# Altium schematic sheet DC-DC Converter_LT3845.SchDoc
size Legal
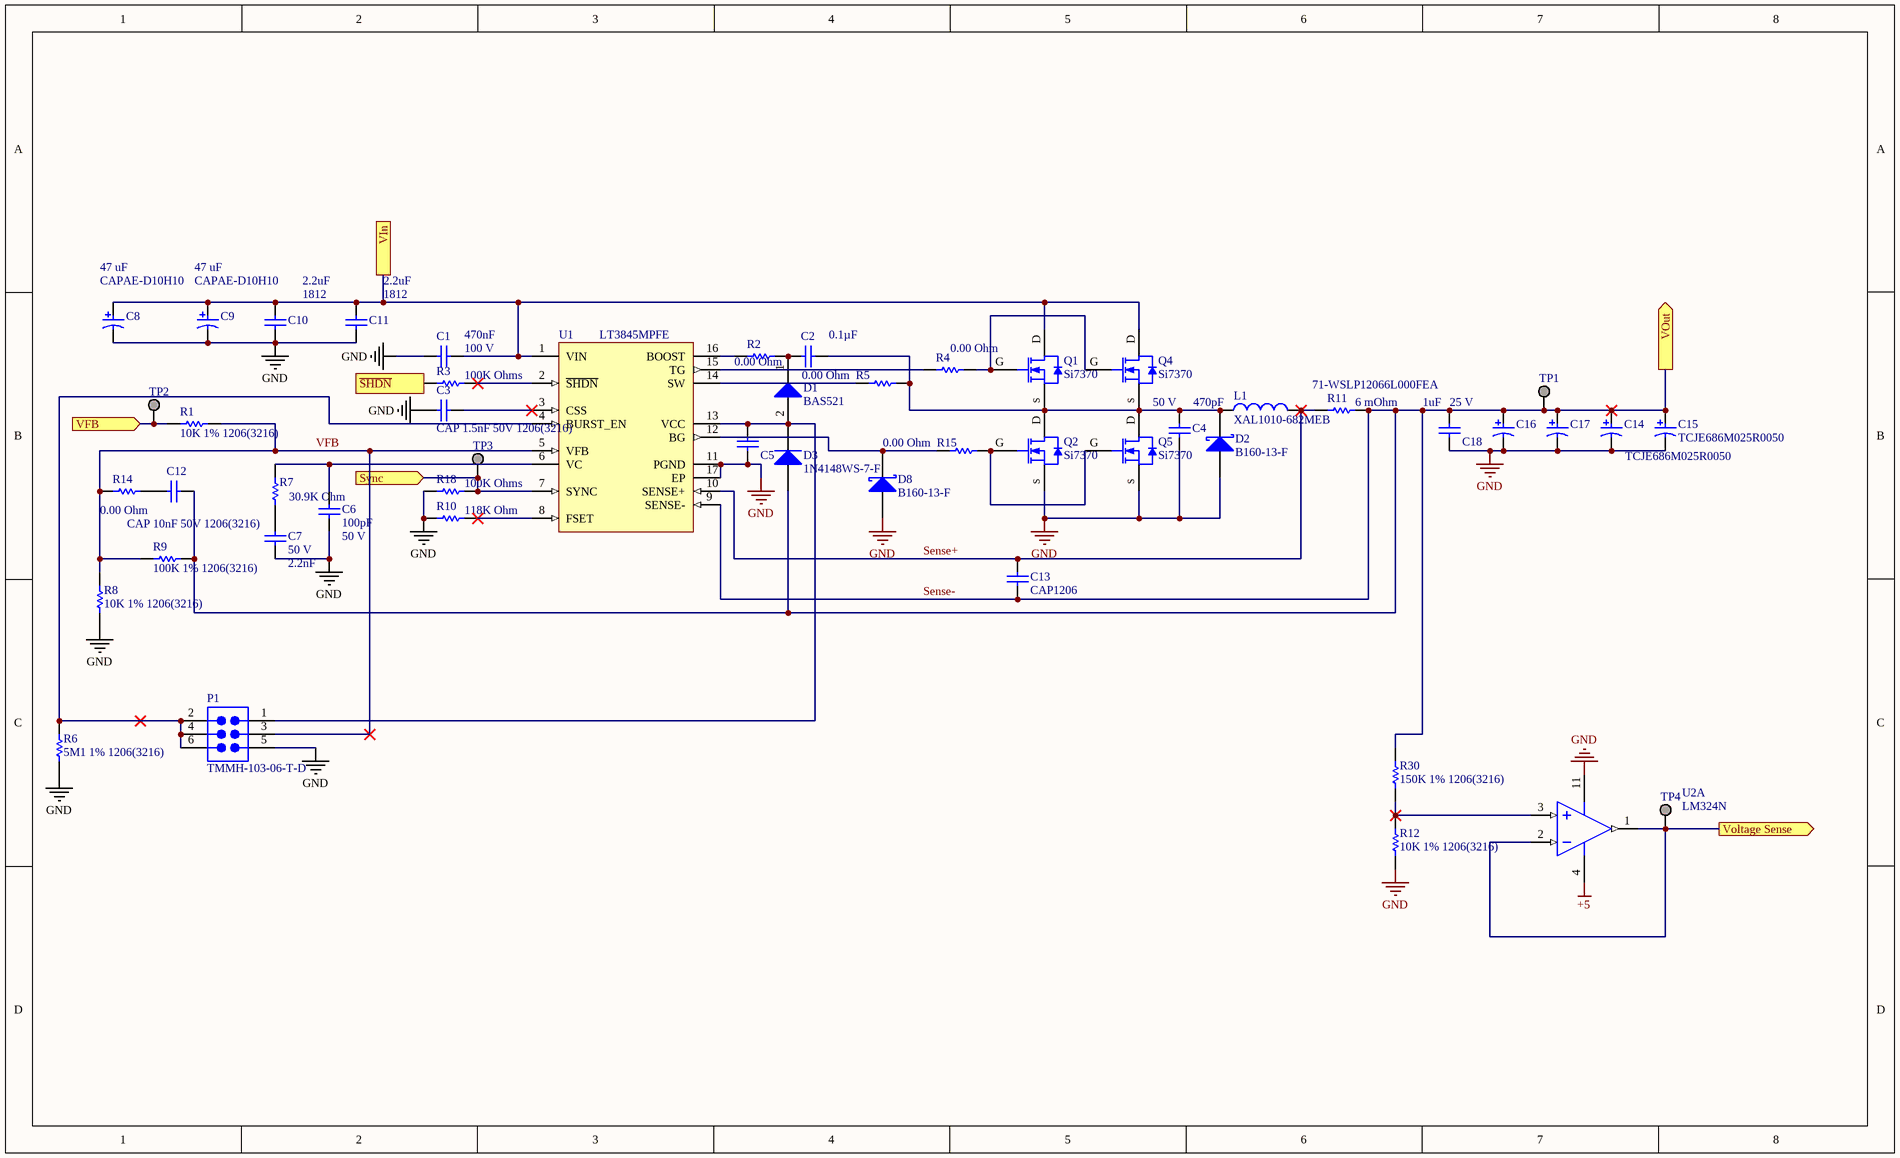
[diagram p0: DC-DC Converter_LT3845.SchDoc]

## Parts
C1  value 470nF  Rated Voltage: 100 V  [CAPC1206(3216)130_L]  (hidden comment: CAP 470nF 100V 1206(3216))
C2  Capacitance: 0.1µF  [KEMT-1206-2_N]  (hidden comment: C1206C104K5RACTU)
C3  CAP 1.5nF 50V 1206(3216)  [CAPC1206(3216)170_L]
C4  value 470pF  Rated Voltage: 50 V  [CAPC1206(3216)100_L]  (hidden comment: CAP 470pF 50V 1206(3216))
C5  CAP 1uF 25V 1206(3216)  [CAPC1206(3216)190_L]  (value not drawn)
C6  value 100pF  Rated Voltage: 50 V  [CAPC1206(3216)170_L]  (hidden comment: CAP 100pF 50V 1206(3216))
C7  value 2.2nF  Rated Voltage: 50 V  [CAPC1206(3216)130_L]  (hidden comment: CAP 2.2nF 50V 1206(3216))
C8  PackageReference: CAPAE-D10H10  Rated Capacitance: 47 uF  [NIC-CAPA2-10X10_V]  (hidden comment: UCZ1J470MCS1GS)
C9  PackageReference: CAPAE-D10H10  Rated Capacitance: 47 uF  [NIC-CAPA2-10X10_V]  (hidden comment: UCZ1J470MCS1GS)
C10  value 2.2uF  Case-EIA: 1812  [CAPC1812(4532)280_L]  (hidden comment: CAP 2.2uF 100V 1812(4532))
C11  value 2.2uF  Case-EIA: 1812  [CAPC1812(4532)280_L]  (hidden comment: CAP 2.2uF 100V 1812(4532))
C12  CAP 10nF 50V 1206(3216)  [CAPC1206(3216)170_L]
C13  CAP1206  [CAPC1206(3216)150_L]
C14  TCJE686M025R0050  [KEMT-520-D_N]
C15  TCJE686M025R0050  [KEMT-520-D_N]
C16  TAJB226K016RNJ  [AVX-TAJ-B-2_L]  (value not drawn)
C17  TAJB226K016RNJ  [AVX-TAJ-B-2_L]  (value not drawn)
C18  value 1uF  Rated Voltage: 25 V  [CAPC1206(3216)190_L]  (hidden comment: CAP 1uF 25V 1206(3216))
D1  PartNumber: BAS521  [ONSC-SOD-523-2-502-01_V]  (hidden comment: BAS16XV2T1)
D2  B160-13-F  [DIOD-SMA-2_V]
D3  1N4148WS-7-F  [DIOD-SOD323-2-A_V]
D8  B160-13-F  [DIOD-SMA-2_V]
L1  XAL1010-682MEB  [INDP113100X100N]
P1  TMMH-103-06-T-D  [SMTC-TMMH-103-06-X-D]
Q1  Si7370  [SOIC127P620X112_HS-9N]
Q2  Si7370  [SOIC127P620X112_HS-9N]
Q4  Si7370  [SOIC127P620X112_HS-9N]
Q5  Si7370  [SOIC127P620X112_HS-9N]
R1  10K 1% 1206(3216)  [RESC1206(3216)_L]
R2  value 0.00 Ohm  [RESC1206(3216)_L]  (hidden comment: Jumper 1206(3216))
R3  value 100K Ohms  [RESC1206(3216)_L]  (hidden comment: 100K 1% 1206(3216))
R4  value 0.00 Ohm  [RESC1206(3216)_L]  (hidden comment: Jumper 1206(3216))
R5  value 0.00 Ohm  [RESC1206(3216)_L]  (hidden comment: Jumper 1206(3216))
R6  5M1 1% 1206(3216)  [RESC1206(3216)_L]
R7  value 30.9K Ohm  [RESC1206(3216)_L]  (hidden comment: 30K9 1% 1206(3216))
R8  10K 1% 1206(3216)  [RESC1206(3216)_L]
R9  100K 1% 1206(3216)  [RESC1206(3216)_L]
R10  value 118K Ohm  [RESC1206(3216)_L]  (hidden comment: 118K 1% 1206(3216))
R11  value 6 mOhm  Supplier Part Number 1: 71-WSLP12066L000FEA  [RESC1206(3216)_L]  (hidden comment: WSLP12066L000FEA)
R12  10K 1% 1206(3216)  [RESC1206(3216)_L]
R14  value 0.00 Ohm  [RESC1206(3216)_L]  (hidden comment: Jumper 1206(3216))
R15  value 0.00 Ohm  [RESC1206(3216)_L]  (hidden comment: Jumper 1206(3216))
R18  value 100K Ohms  [RESC1206(3216)_L]  (hidden comment: 100K 1% 1206(3216))
R30  150K 1% 1206(3216)  [RESC1206(3216)_L]
TP1  VOut  [KSTN-1502-2]  (value not drawn)
TP2  VFB  [KSTN-1502-2]  (value not drawn)
TP3  Sync  [KSTN-1502-2]  (value not drawn)
TP4  Voltage Sense  [KSTN-1502-2]  (value not drawn)
U1  LT3845MPFE  [LT-FE-16-EPV-BC_N]
U2  LM324N  [N14A]  (part A of 4)

## Ports
Sync (in), VFB (in), VIn, Voltage Sense (out), VOut (out), ~{SHDN} (in)

## Nets
+5: U2.4(V+)
GND: C1.1 C3.1 C4.1 C5.1 C6.1 C7.1 C8.2 C9.2 C10.1 C11.1 C14.2 C15.2 C16.2 C17.2 C18.1 D2.1(A) D8.1(A) P1.5 Q2.S Q5.S R6.1 R8.1 R10.1 R12.2 R18.1 U1.11(PGND) U1.17(EP) U2.11(GND)
~{SHDN}: R3.1 ; port ~{SHDN}
Sense+: C13.2 L1.2 R11.1 U1.10(SENSE+)
Sense-: C12.2 C13.1 C14.1 C15.1 C16.1 C17.1 C18.2 D3.1(A) R9.2 R11.2 R30.2 TP1.1 U1.9(SENSE-) ; port VOut
Sync: R18.2 TP3.1 U1.7(SYNC) ; port Sync
VFB: P1.3 R1.2 R8.2 R9.1 R14.1 U1.5(VFB)
VFB: R1.1 TP2.1 ; port VFB  [a separate net that carries the same name]
VIn: C1.2 C8.1 C9.1 C10.2 C11.2 Q1.D Q4.D U1.1(VIN) ; port VIn
Voltage Sense: TP4.1 U2.1(OUT1) U2.2(IN1-) ; port Voltage Sense
NetC2_1: C2.1 D1.1(K) R2.2
NetC2_2: C2.2 C4.2 D2.2(K) L1.1 Q1.S Q2.D Q4.S Q5.D R5.2
NetC3_2: C3.2 U1.3(CSS)
NetC5_2: C5.2 D1.2(A) D3.2(K) P1.1 U1.13(VCC)
NetC6_2: C6.2 R7.2 U1.6(VC)
NetC7_2: C7.2 R7.1
NetC12_1: C12.1 R14.2
NetD8_2: D8.2(K) R15.1 U1.12(BG)
NetP1_2: P1.2 P1.4 P1.6 R6.2 U1.4(BURST_EN)
NetQ1_G: Q1.G Q4.G R4.2
NetQ2_G: Q2.G Q5.G R15.2
NetR2_1: R2.1 U1.16(BOOST)
NetR3_2: R3.2 U1.2(~{SHDN})
NetR4_1: R4.1 U1.15(TG)
NetR5_1: R5.1 U1.14(SW)
NetR10_2: R10.2 U1.8(FSET)
NetR12_1: R12.1 R30.1 U2.3(IN1+)

## Library data of the parts
C1 = CMP-1037-04578-1: CAP 470nF 100V ±10% 1206 (3216 Metric) Thickness 1.3mm SMD; Case-Metric: 3216; Case-EIA: 1206; Tolerance: Â±10%; Technology: SMT; Max Thickness: 1.3 mm; Supplier 1: Mouser; Supplier Part Number 1: 810-C3216X5R2A474K1A
C2 = CMP-2000-05169-1: CAP, Ceramic, 0.1 uF, +/- 10%, 50 V, -55 to 125 degC, 1206 (3216 Metric), RoHS, Tape and Reel; Manufacturer: Kemet; Voltage Rating: 50V; Product Range: KEMET-CSeries; SVHC: ToBeAdvised; Dielectric Characteristic: X7R; Capacitor Case Style: 1206[3216Metric]; Package Reference: 1206-2; Package Description: 2-Leads SMD, Body 3.2 x 1.6 mm; Packaging: Tape&Reel; Operating Temperature Max: 125degC; Capacitance Tolerance: ±10%; Datasheet URL: https://datasheet.ciiva.com/6125/1725438-6125494.pdf; Manufacturer URL: http://www.kemet.com/; Operating Temperature Min: -55degC; Datasheet Version: Jul-13
C3 = CMP-1037-02618-1: CAP 1.5nF 50V ±10% 1206 (3216 Metric) Thickness 1.7mm SMD; Case-Metric: 3216; Case-EIA: 1206; Tolerance: Â±10%; Rated Voltage: 50 V; Technology: SMT; Value: 1.5nF; Max Thickness: 1.7 mm
C4 = CMP-1037-02150-1: CAP 470pF 50V ±10% 1206 (3216 Metric) Thickness 1mm SMD; Case-Metric: 3216; Case-EIA: 1206; Tolerance: Â±10%; Max Thickness: 1 mm; Technology: SMT
C5 C18 = CMP-1037-04699-1: CAP 1uF 25V ±5% 1206 (3216 Metric) Thickness 1.9mm SMD; Tolerance: Â±5%; Case-EIA: 1206; Case-Metric: 3216; Max Thickness: 1.9 mm; Technology: SMT
  C5: Rated Voltage: 25 V; Value: 1uF
C6 = CMP-1037-01575-1: CAP 100pF 50V ±10% 1206 (3216 Metric) Thickness 1.7mm SMD; Tolerance: Â±10%; Case-Metric: 3216; Case-EIA: 1206; Technology: SMT; Max Thickness: 1.7 mm
C7 = CMP-1037-02790-1: CAP 2.2nF 50V ±10% 1206 (3216 Metric) Thickness 1.3mm SMD; Case-Metric: 3216; Case-EIA: 1206; Tolerance: Â±10%; Technology: SMT; Max Thickness: 1.3 mm
C8 C9 = CMP-0687-00002-1: Aluminum Electrolytic Capacitor, UD Series, Low Impedance, 470 uF, 25 V, + / - 20%, -55 to 105 degC, Chip Type, 10 x 10 mm D x L, Pb-Free, Reel; Manufacturer: Nichicon; Impedance: 0.09 Ohm; Endurance Time: 5000 h; Rated Ripple Current (at 100kHz): 670 mA; Packing: Dia382mm Reel; Rated Voltage: 63V; Tolerance Rated Capacitance: -20 to 20%; ComponentLink3URL: http://products.nichicon.co.jp/en/pdf/XJA043/e-ud.pdf; ComponentLink2URL: http://products.nichicon.co.jp/en/pdf/XJA043/e-ud.pdf; Length: 10 mm; PartNumber: UCZ1J470MCS1GS; ComponentLink3Description: Package Specification; ComponentLink1URL: http://www.nichicon.co.jp/; DatasheetVersion: 08/2012; ComponentLink1Description: Manufacturer URL; ComponentLink2Description: Datasheet; Diameter: 10 mm; PackageDescription: 2-Pin Surface Mount Device, Diameter 10 mm, Height 10 mm, Pitch 8 mm; RoHS: TRUE; Mounting Technology: Surface Mount; Supplier 1: Mouser; Supplier Part Number 1: 647-UCZ1J470MCS1GS
C10 C11 = CMP-1040-01635-1: CAP 2.2uF 100V ±10% 1812 (4532 Metric) Thickness 2.8mm SMD; Case-Metric: 4532; Tolerance: Â±10%; Rated Voltage: 100 V; Max Thickness: 2.8 mm; Technology: SMT; Supplier 1: Digi-Key; Supplier Part Number 1: 445-4510-2-ND
C12 = CMP-1037-03512-1: CAP 10nF 50V ±10% 1206 (3216 Metric) Thickness 1.7mm SMD; Case-Metric: 3216; Case-EIA: 1206; Tolerance: Â±10%; Value: 10nF; Max Thickness: 1.7 mm; Technology: SMT; Rated Voltage: 50 V
C13 = CMP-1590-00001-1: 1206 (3216 Metric) Chip Capacitor; Case-Metric: 3216; Case-EIA: 1206; Placement: 0; PackageReference: CAPC1206(3216)150
C14 C15 = CMP-1664-00003-1: Tantalum Capacitor, 68 uF, +/- 20%, 25 V, -55 to 105 degC, 2-Pin Molded, RoHS, Tape and Reel; PartNumber: TCJE686M025R0050; Width: 0.169 inch; Height: 3.1 mm; Mount: Surface Mount; RoHSCompliant: True; Min Operating Temperature: -55 degC; Radiation Hardening: No; Mounting Technology: Surface Mount; Max Operating Temperature: 105 degC; ComponentLink1Description: Manufacturer URL; PackageDescription: 2-Pin Surface Mount Device, Body 7.3 x 4.3 mm; Length: 0.287 inch; ComponentLink2URL: http://capacitoredge.kemet.com/capedge2/DataSheet/Datasheet-T520D337M006ATE009.pdf?pn=T520D337M006ATE009; ComponentLink2Description: Datasheet; Packaging: Tape and Reel; ComponentLink1URL: http://www.kemet.com/; REACH SVHC: No SVHC; Case/Package: 2917; Package Quantity: 1; DatasheetVersion: 07/2016; Supplier 1: Mouser; Supplier Part Number 1: 581-TCJE686M025R0050
C16 C17 = CMP-2100-03689-1: Standard Tantalum, 22 uF, +/- 10%, 16 V, -55 to 125 degC, 2-Pin SMD (1210), RoHS, Tape and Reel; Manufacturer: AVX; Leakage Current: 3.5uA; Dissipation Factor: 6%; Voltage Rating (DC): 16V; Capacitance: 22uF; ESR (Equivalent Series Resistance): 2.3Ohm; Polarity: Polar; Package Quantity: 1; Tolerance: 10%; Number of Pins: 2; Manufacturer URL: http://www.avx.com/; Height - Seated (Max): 0.083inch; Case Code (Imperial): 1210; Package Reference: TAJ-B-2; Height: 1.9mm; Depth: 2.8mm; Packaging: TapeandReel; Termination: SMD/SMT; Case/Package: 1210; Lead Free: LeadFree; Min Operating Temperature: -55degC; RoHSCompliant: True; Dielectric Material: Tantalum; Case Code (Metric): 3528; Width: 2.8mm; Datasheet URL: http://datasheets.avx.com/TAJ.pdf; Radiation Hardening: No; Package Description: 2-Pin Surface Mount Device, Body 3.5 x 2.85 mm; Length: 3.5mm; Voltage Rating: 16V; Datasheet Version: 42401.0; Max Operating Temperature: 125degC; REACH SVHC: NoSVHC; Voltage: 16V
D1 = CMP-1054-00073-1: Switching Diode, 2-Pin SOD-523, Tape and Reel; Manufacturer: On Semiconductor; Configuration: Single; trr Max (ns): 6; IF Max (A): 0.2; ComponentLink3URL: http://www.onsemi.com/pub_link/Collateral/502-01.PDF; ComponentLink1Description: Manufacturer URL; PackageVersion: Rev. E, 09/2010; PackageReference: SOD-523-2-502-01; ComponentLink2URL: http://www.onsemi.com/pub_link/Collateral/BAS16XV2T1-D.PDF; Packing: Tape and Reel; Mounting Technology: Surface Mount; RoHS: FALSE; ComponentLink3Description: Package Specification; ComponentLink2Description: Datasheet; DatasheetVersion: Rev. 7; PackageDescription: 2-Pin SOD, Body 1.2 x 0.8 mm; ComponentLink1URL: http://www.onsemi.com/; Supplier 1: Mouser; Supplier Part Number 1: 621-BAS521-7
D2 D8 = CMP-1667-00003-1: Surface Mount Schottky Barrier Rectifier, 40 V, 3 A, -55 to 150 degC, 2-Pin SMA, RoHS, Tape and Reel; Forward Current: 3 A; Forward Voltage: 500 mV; Max Surge Current: 80 A; Peak Reverse Current: 500 uA; Elements: 1; Mounting Technology: Surface Mount; ComponentLink1URL: http://www.diodes.com/; PackageDescription: 2-Pin Surface Mounted Assembly, Body 4.3 x 2.605 mm, Height 2.4 mm; Min Operating Temperature: -55 degC; Mount: Surface Mount; Pins: 2; ComponentLink2URL: http://www.diodes.com/_files/datasheets/ds30891.pdf; PackageReference: SMA-2; Max Operating Temperature: 125 degC; Radiation Hardening: No; Length: 4.6 mm; RoHSCompliant: true; ComponentLink1Description: Manufacturer URL; Height: 2.1 mm; ComponentLink2Description: Datasheet; Packaging: Tape and Reel; Package Quantity: 5000; Case\Package: SMA; DatasheetVersion: Rev. 17 - 2, 09/2015; REACH SVHC: No SVHC; Width: 2.92 mm; Supplier 1: Mouser; Supplier Part Number 1: 621-B160-F
D3 = CMP-1667-00004-1: Fast Switching Diode, 75 V, 0.3 A, -65 to 150 degC, 2-Pin SOD323, RoHS, Tape and Reel; DatasheetVersion: Rev. 25-2, 03/2016; PackageDescription: 2-Pin Small Outline Diode, Body 1.7 x 1.3 mm; ComponentLink2Description: Datasheet; ComponentLink1URL: http://www.diodes.com/; PackageReference: SOD323-2; ComponentLink2URL: http://www.diodes.com/datasheets/ds30097.pdf; ComponentLink1Description: Manufacturer URL
L1 = IND-2: Supplier 1: Mouser; Supplier Part Number 1: 994-XAL1010-682MEB
P1 = CMP-1029-00207-1: Flexible Through-Hole Header, Vertical, -55 to 105 degC, 2 mm Pitch, 6-Pin, Male, RoHS; Manufacturer: Samtec; Pitch: 2 mm; PackageReference: TMMH-103-06-X-D; ComponentLink1Description: Manufacturer URL; PackageDescription: 2mm x 2mm Terminal Strip Assembly; ComponentLink2URL: http://d2a072wq521u33.cloudfront.net/catalog_english//TMMH_TH.PDF; PackageVersion: AR, 12/1996; Temperature Range: -55 to 105 degC; ComponentLink3Description: Package Specification; ComponentLink3URL: http://www.samtec.com/documents/webfiles/cpdf/TMMH-1XX-XX-XX-D-XXX-XXX-MKT1.pdf; RoHS: True; ComponentLink2Description: Datasheet; PartNumber: TMMH-103-06-T-D; Orientation: Vertical; DatasheetVersion: F-214; Mounting Technology: Through-hole; ComponentLink1URL: http://www.samtec.com
Q1 Q2 Q4 Q5 = Si7370: N-Channel 60 V (D-S) MOSFET; ComponentLink1Description: Datasheet; ComponentLink1URL: https://www.vishay.com/docs/71874/si7370dp.pdf; Supplier 1: Mouser; Supplier Part Number 1: 781-SI7370DP-GE3
R1 R8 R12 = CMP-1014-00623-1: 10K 0.25W 1% 1206 (3216 Metric)  SMD; Case-Metric: 3216; Value: 10000.00 Ohm; Case-EIA: 1206; Power: 0.25 W; Technology: SMT; Tolerance: 1 %
R2 R4 R5 R14 R15 = CMP-1014-00001-1: Jumper 1206 (3216 Metric); Tolerance: None; Case-EIA: 1206; Case-Metric: 3216; Technology: SMT; Power: None
R3 R18 = CMP-1014-00736-1: 100K 0.25W 1% 1206 (3216 Metric)  SMD; Case-EIA: 1206; Case-Metric: 3216; Tolerance: 1 %; Power: 0.25 W; Technology: SMT
R6 = CMP-1014-00929-1: 5M1 0.25W 1% 1206 (3216 Metric)  SMD; Case-EIA: 1206; Value: 5100000.00 Ohm; Case-Metric: 3216; Technology: SMT; Tolerance: 1 %; Power: 0.25 W
R7 = CMP-1014-00677-1: 30K9 0.25W 1% 1206 (3216 Metric)  SMD; Case-EIA: 1206; Case-Metric: 3216; Power: 0.25 W; Tolerance: 1 %; Technology: SMT
R9 = CMP-1014-00736-1: 100K 0.25W 1% 1206 (3216 Metric)  SMD; Case-EIA: 1206; Value: 100000.00 Ohm; Case-Metric: 3216; Tolerance: 1 %; Power: 0.25 W; Technology: SMT
R10 = CMP-1014-00743-1: 118K 0.25W 1% 1206 (3216 Metric)  SMD; Case-EIA: 1206; Case-Metric: 3216; Power: 0.25 W; Technology: SMT; Tolerance: 1 %
R11 = CMP-1591-00005-1: 1206 (3216 Metric) Chip Resistor; Case-Metric: 3216; Case-EIA: 1206; PackageReference: RESC1206(3216); Supplier 1: Mouser
R30 = CMP-1014-00754-1: 150K 0.25W 1% 1206 (3216 Metric)  SMD; Case-EIA: 1206; Value: 150000.00 Ohm; Case-Metric: 3216; Technology: SMT; Power: 0.25 W; Tolerance: 1 %
TP1-TP4 = CMP-1672-00001-4: Terminal DBL Turret, Through Hole, RoHS; Contact Finish: Tin; Lead Pitch: 0.218 inch; PackageReference: 1502-2; Mount: Through Hole; Pins: 50; DatasheetVersion: Rev. A, 02/2008; RoHSCompliant: true; REACH SVHC: No SVHC; Contact Material: Brass; Length: 2.77 mm; PackageDescription: 1-Pin Through Hole Device, Dia 3.18 mm; Package Quantity: 1; Mounting Technology: Through Hole; Supplier 1: Mouser; Supplier Part Number 1: 575-2501200800000
U1 = CMP-0491-00624-1: High Voltage Synchronous Current Mode Step-Down Controller with Adjustable Operating Frequency, 16-pin SOP (FE-16-EPV-BC), -55 to 125 degC; Manufacturer: Linear Technology; Frequency Adjust Range: 100kHz - 500kHz; Number of Outputs: 1; ComponentLink1URL: http://www.linear.com/; ComponentLink3URL: http://cds.linear.com/docs/en/packaging/05081663__J_FE16(BC).pdf; ComponentLink2URL: http://cds.linear.com/docs/en/datasheet/3845fd.pdf; RoHS: FALSE; Mounting Technology: Surface Mount; ComponentLink1Description: Manufacturer URL; PartNumber: LT3845MPFE; ComponentLink3Description: Package Specification; PackageReference: FE-16; DatasheetVersion: Rev. D; ComponentLink2Description: Datasheet; PackageDescription: 16-Pin Plastic TSSOP, Body 5 x 4.4 mm, Pitch 0.65 mm; PackageVersion: Rev. J, 11/2012
U2 = CMP-0055-00082-1: Low Power Quad Operational Amplifier, 14-pin MDIP; Manufacturer: National Semiconductor; PackageTopMarking: NSUZXYYTTE#*LM324N; PowerWise: N; CompType: Amplifiers; PinCount: 14; PackageVersion: revG, May-2006; PackageReference: N14A; Code_JEDEC: MS-001-AA; PackageDescription: MDIP, .750 x .250 x.130in, 14 Lead, .100in Pitch; RoHS: N; DatasheetVersion: Aug-2000